# Altium schematic sheet IOandFPGA.SchDoc
size A; SheetNumber: 2; SheetTotal: 4
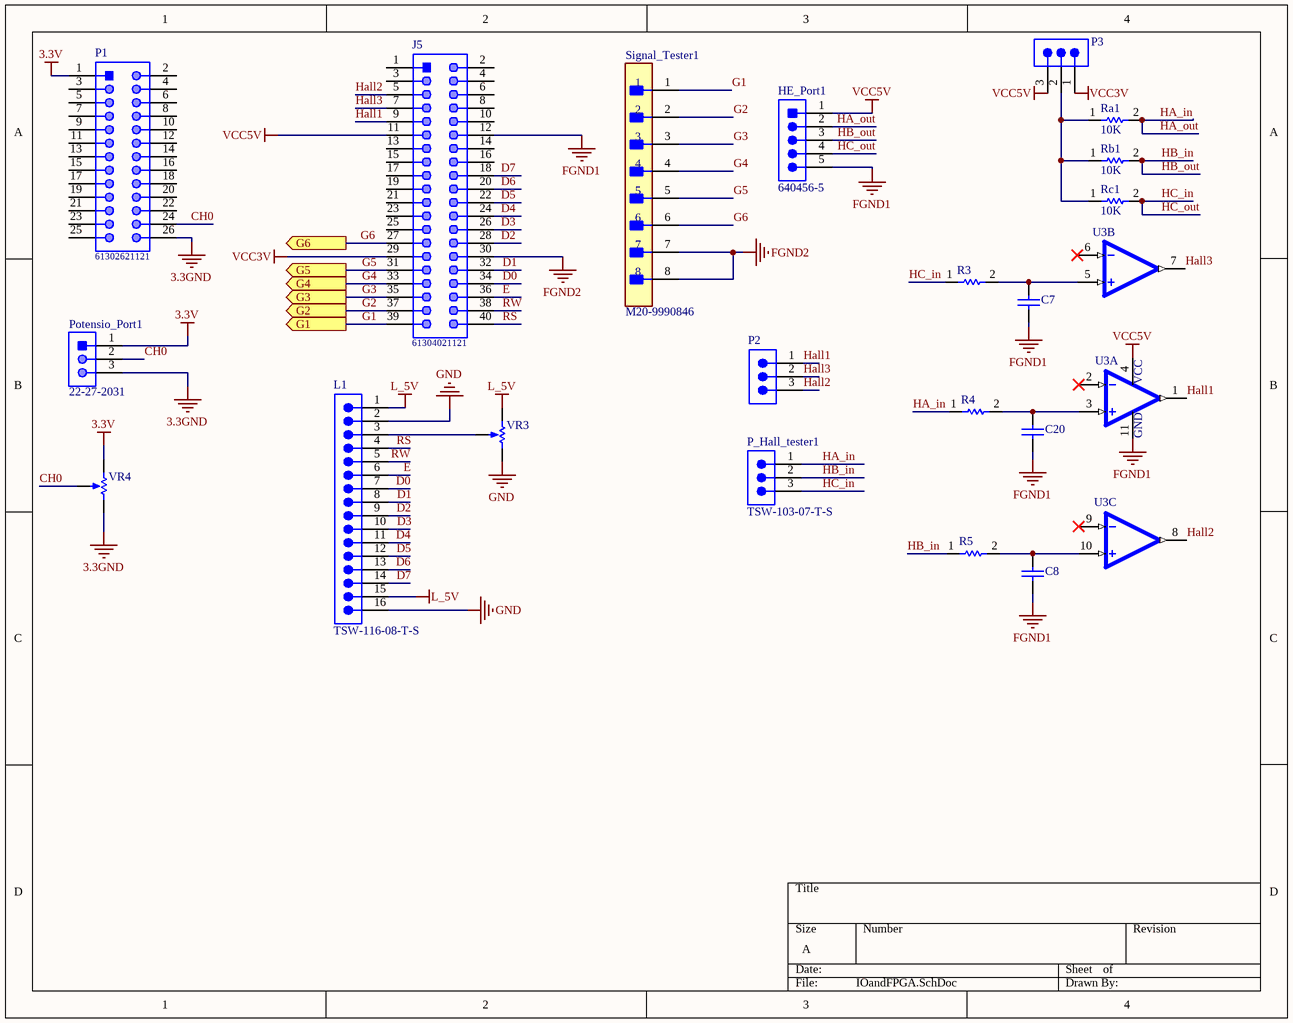
[diagram p0: IOandFPGA.SchDoc]

## Parts
C7  0.1µF  [Cap-0.1uf-50V-Ceramic1]  (value not drawn)
C8  0.1µF  [Cap-0.1uf-50V-Ceramic1]  (value not drawn)
C20  0.1µF  [Cap-0.1uf-50V-Ceramic1]  (value not drawn)
HE_Port1  640456-5  [Conn-Wire-header-5pin]
J5  61304021121  [Pin-Header-2x20pin]
L1  TSW-116-08-T-S  [LCD1602]
P1  61302621121  [DE0-nano]
P2  TSW-103-07-T-S  [Pin-Header-3pin]  (value not drawn)
P3  TSW-103-07-T-S  [Pin-Header-3pin]  (value not drawn)
P_Hall_tester1  TSW-103-07-T-S  [Pin-Header-3pin]
Potensio_Port1  22-27-2031  [Conn-Wire-header-3pin]
R3  Resistor-1-Watt  [Resistor-1-Watt]  (value not drawn)
R4  Resistor-1-Watt  [Resistor-1-Watt]  (value not drawn)
R5  Resistor-1-Watt  [Resistor-1-Watt]  (value not drawn)
Ra1  10K  [Resistor-1-Watt]
Rb1  10K  [Resistor-1-Watt]
Rc1  10K  [Resistor-1-Watt]
Signal_Tester1  M20-9990846  [Pin-Header-8pin]
U3  Op-Amp_LM324  [Op-Amp_LM324]  (value not drawn)  (parts A,B,C of 4)
VR3  3296W-1-103LF  [Resistor-Trimmer]  (value not drawn)
VR4  3852A-282-103AL  [Potentiometer]  (value not drawn)

## Ports
G1 (out), G2 (out), G3 (out), G4 (out), G5 (out), G6 (out)

## Nets
3.3GND: P1.26 Potensio_Port1.3 VR4.3(CW)
3.3V: P1.1 Potensio_Port1.1 VR4.1(CCW)
FGND1: C7.1 C8.1 C20.1 HE_Port1.5(CTS) J5.12 U3.11(GND)
FGND2: J5.30 Signal_Tester1.7 Signal_Tester1.8
GND: L1.2 L1.16 VR3.3(CW)
L_5V: L1.1 L1.15 VR3.1(CCW)
VCC3V: J5.29 P3.1
VCC5V: HE_Port1.1(DTR) J5.11 P3.3 U3.4(VCC)
CH0: P1.24 Potensio_Port1.2 VR4.2(S)
D0: J5.34 L1.7
D1: J5.32 L1.8
D2: J5.28 L1.9
D3: J5.26 L1.10
D4: J5.24 L1.11
D5: J5.22 L1.12
D6: J5.20 L1.13
D7: J5.18 L1.14
E: J5.36 L1.6
G1: J5.39 Signal_Tester1.1 ; port G1
G2: J5.37 Signal_Tester1.2 ; port G2
G3: J5.35 Signal_Tester1.3 ; port G3
G4: J5.33 Signal_Tester1.4 ; port G4
G5: J5.31 Signal_Tester1.5 ; port G5
G6: J5.27 Signal_Tester1.6 ; port G6
HA_in: HE_Port1.2(RXI) P_Hall_tester1.1 R4.1 Ra1.2  [also labelled HA_out]
Hall1: J5.9 P2.1 U3.1(1OUT)
Hall2: J5.5 P2.3 U3.8(3OUT)
Hall3: J5.7 P2.2 U3.7(2OUT)
HB_in: HE_Port1.3(TXO) P_Hall_tester1.2 R5.1 Rb1.2  [also labelled HB_out]
HC_in: HE_Port1.4(VCC) P_Hall_tester1.3 R3.1 Rc1.2  [also labelled HC_out]
RS: J5.40 L1.4
RW: J5.38 L1.5
NetC7_2: C7.2 R3.2 U3.5(2IN+)
NetC8_2: C8.2 R5.2 U3.10(3IN+)
NetC20_2: C20.2 R4.2 U3.3(1IN+)
NetL1_3: L1.3 VR3.2(S)
NetP3_2: P3.2 Ra1.1 Rb1.1 Rc1.1

Not connected (* = marked no-connect by the designer): J5 1 2 3 4 6 8 10 13 14 15 16 17 19 21 23 25; P1 2 3 4 5 6 7 8 9 10 11 12 13 14 15 16 17 18 19 20 21 22 23 25; U3 2(1IN-)* 6(2IN-)* 9(3IN-)*

## Library data of the parts
C7 C8 C20 = Cap-0.1uf-50V-Ceramic_1: Lead Capacitor X7R_EIA_ with Capacitance: 0.10F and Rated Voltage: 50Vdc; MP: RDER71H104K0K1H03B; MF: Murata; Package: NONSTANDARD; Price: None; Availability: Unavailable; Value: *; SnapEDA_Link: https://www.snapeda.com/parts/RDER71H104K0K1H03B/Murata/view-part/4545566/?ref=snap
HE_Port1 = Conn-Wire-header-5pin: Male Header, Pitch 2.54 mm, 1 x 5 Position, Height 10.03 mm, Tail Length 3.56 mm, / -55 to 105 degC, RoHS, Bulk; Manufacturer: TE Connectivity; Material, Housing: Polyester; Brand/Series: MTA-100Series; Color, Housing: White; Current, Rating: 5 / A; Temperature, Operating: -55to+105 / °C; Connector Type: MTA-100; Agency Approvals: CSA,UL; Material, Contact: CopperAlloy; Mounting Hole Size: 0.04 / "; Voltage, Rating: 250 / V; Contact Termination Area Plating: Tin; Pin Spacing: 0.1 / "; Primary Type: InterconnectSystem; Special Features: Pinstrip; Mount Angle: Vertical; Contact Centerline Spacing: 0.100 / in.; Number of Contacts: 5; Standards: RoHSCompliant,ELVCompliant,UL94V-0; Angle: Straight; Manufacturer URL: http://www.te.com; Package Reference: THD; Datasheet URL: http://sigma.octopart.com/77881742/technical_drawing/TE-Connectivity-640456-5.pdf; Package Description: Male Header, Pitch 2.54 mm, 1 x 5 Position, Height 10.03 mm, Tail Length 3.56 mm; Datasheet Version: Rev. W3; Length, Terminal Post: 0.14 / in.; Flammability Rating: UL94V-0; Mounting Type: PCMount; Termination: Solder; Length, Overall: 0.5 / "; Contact Mating Area Plating: Tin; Length, Pin: 0.14 / "; Contact Plating: Tin; Color: White; Number of Positions: 5; Type: PCBPlug; Contact Shape: Square; Number of Rows: 1; Size, Post: 0.025 / in.
J5 = Pin-Header-2x20P: THT Vertical Pin Header WR-PHD, Pitch 2.54 mm, Dual Row, 40 pins; Manufacturer: Wurth Elektronik; Contact Resistance: 20mOhm; Pitch: 2.54mm; Pin Number: 40; Withstanding Voltage: 500VAC; Gender: Male; Rated Current: 3A; Working Voltage: 250VAC; Operating Temperature: -40to105degC; Manufacturer URL: http://www.we-online.de; Orientation: Vertical; Datasheet URL: https://katalog.we-online.de/em/datasheet/6130xx21121.pdf; Package Reference: 61304021121; Row Number: Dual; Part Number: 61304021121; Packaging: Bag; Mounting Technology: THT; Publisher: WurthElektronik
L1 = LCD1602: 0.025" SQ Post Header, Through-hole, Vertical, -55 to 105 degC, 2.54 mm Pitch, 16-Pin, Male, RoHS; Manufacturer: Samtec; Pitch: 2.54 mm; PackageDescription: .025[0.64] SQ. Post Terminal Strip Assembly; Orientation: Vertical; DatasheetVersion: F-214; ComponentLink2URL: http://www.samtec.com/documents/webfiles/pdf/TSW_TH.PDF; ComponentLink3URL: http://www.samtec.com/documents/webfiles/cpdf/TSW-XXX-XX-XXX-X-XX-XXX-MKT.pdf; ComponentLink1URL: http://www.samtec.com; PackageReference: TSW-116-08-X-S; ComponentLink2Description: Datasheet; ComponentLink1Description: Manufacturer URL; ComponentLink3Description: Package Specification; Temperature Range: -55 to 105 degC; Mounting Technology: Through-hole; PartNumber: TSW-116-08-T-S; PackageVersion: DM, 8/1988; RoHS: True
P1 = DE0_NANO: THT Vertical Pin Header WR-PHD, Pitch 2.54 mm, Dual Row, 26 pins; Manufacturer: Wurth Elektronik; Pin Number: 26; Withstanding Voltage: 500VAC; Working Voltage: 250VAC; Contact Resistance: 20mOhm; Pitch: 2.54mm; Rated Current: 3A; Gender: Male; Package Reference: 61302621121; Manufacturer URL: http://www.we-online.de; Row Number: Dual; Packaging: Bag; Publisher: WurthElektronik; Datasheet URL: https://katalog.we-online.de/em/datasheet/6130xx21121.pdf; Operating Temperature: -40to105degC; Mounting Technology: THT; Orientation: Vertical; Part Number: 61302621121
P2 P3 P_Hall_tester1 = Pin-Header-3pin: 0.025" SQ Post Header, Through-hole, Vertical, -55 to 105 degC, 2.54 mm Pitch, 3-Pin, Male, RoHS; Manufacturer: Samtec; Pitch: 2.54 mm; ComponentLink1URL: http://www.samtec.com; ComponentLink3URL: http://www.samtec.com/documents/webfiles/cpdf/TSW-XXX-XX-XXX-X-XX-XXX-MKT.pdf; PartNumber: TSW-103-07-T-S; Mounting Technology: Through-hole; RoHS: True; DatasheetVersion: F-214; PackageVersion: DM, 8/1988; Temperature Range: -55 to 105 degC; ComponentLink2Description: Datasheet; ComponentLink1Description: Manufacturer URL; Orientation: Vertical; PackageReference: TSW-103-07-X-S; ComponentLink3Description: Package Specification; ComponentLink2URL: http://www.samtec.com/documents/webfiles/pdf/TSW_TH.PDF; PackageDescription: .025[0.64] SQ. Post Terminal Strip Assembly
Potensio_Port1 = Conn-Wire-header-3pin: Male Header, Pitch 2.54 mm, 1 x 3 Position, Height 11.7 mm, Tail Length 3.56 mm, -40 to 80 degC, RoHS, Bulk; Manufacturer: Molex; Voltage rating: 250V; Current rating: 4A; Package Reference: 22-27-2031; Housing material: Nylon(UL94V-0); Operating temperature: 0°Cto+75°C; Package Description: Male Header, Pitch 2.54 mm, 1 x 3 Position, Height 11.7 mm, Tail Length 3.56 mm; Package URL: http://www.molex.com/pdm_docs/sd/022272031_sd.pdf; Datasheet Version: 06/2016; Manufacturer URL: http://www.molex.com/; Mounting Technology: ThroughHole; Datasheet URL: http://www.molex.com/webdocs/datasheets/pdf/en-us/0022272031_PCB_HEADERS.pdf; Contact material: Tinplatedbrass
R3-R5 Ra1 Rb1 Rc1 = Resistor-1-Watt: Resistor; Manufacturer_Name: Ohmite; Manufacturer_Part_Number: OK1025E-R52; Datasheet Link: https://www.alliedelec.com/m/d/7f961050c862e52d900c42b673f6b00a.pdf; Mouser Part Number: 588-OK1025E-R52; Mouser Price/Stock: https://www.mouser.co.uk/ProductDetail/Ohmite/OK1025E-R52?qs=AkUtuiJmyfnfEYTpIxxGIg%3D%3D
Signal_Tester1 = Pin-Header-8pin: CONN HEADER VERT 8POS 2.54MM; Connector Type: Male Pin; Gender: Male; Insulation Resistance: 1GR; Number of Positions: 8; Contact Resistance: 30mR; Current Rating: 3A; Termination: Solder; Case/Package: SIL; RoHS Compliant: Yes; Series: M20; Housing Material: Nylon; Radiation Hardening: No; Package Quantity: 1000; Contact Material: Brass; Contact Plating: Tin; Max Operating Temperature: 105°C; Contact Mating Length: 0.24inch; Depth: 2.54mm; Color: Black; Number of Contacts: 8; Mount: Through Hole; Number of Rows: 1; Packaging: Bulk; Min Operating Temperature: -40°C; Max Current Rating: 3A; REACH SVHC: No SVHC; Pitch: 2.54mm; Housing Color: Black; Orientation: Straight; Length: 20.32mm; Contact Type: Male Pin
U3 = Op-Amp_LM324: MP: LM324NE3; Package: None; Availability: Unavailable; Price: None; Value: *
VR3 = Resistor-Trimmer: Square Trimpot(R) Trimming Potentiometer, 10 KOhm, +/- 10%, 0.5 W, -55 to 125 degC, 3-Pin THD, RoHS, Tube; Voltage Rating: 75 V; Resistance: 120 Ohm; Tolerance: 1%; Power Rating: 100 mW; Case\Package: 0603; Type (Resistor): Thick Film; PackageDescription: 3-Pin Through Hole Device, Body 9.53 x 4.83 mm, Pitch 2.54 mm; RoHSCompliant: true; Package Quantity: 5000; Case Code (Metric): 1608; PackageReference: 3296W; ComponentLink2Description: Datasheet; REACH SVHC: Unknown; Case Code (Imperial): 0603; ComponentLink1URL: http://www.bourns.com/; Width: 0.85 mm; Radiation Hardening: No; Min Operating Temperature: -55 degC; Mount: Surface Mount; ComponentLink1Description: Manufacturer URL; Max Operating Temperature: 155 degC; Weight: 7.1E-05 oz; Pins: 2; DatasheetVersion: May-16; Packaging: Tape and Reel; Height: 0.45 mm; Length: 1.55 mm; ComponentLink2URL: http://www.bourns.com/docs/Product-Datasheets/3296.pdf
VR4 = Potentiometer: Diameter Panel Control, 10 KOhm, +/- 10%, 2 W, -1 to 125 degC, 3-Pin THD, RoHS, Bulk; Manufacturer: Bourns; Temperature Coefficient: ±150ppm/degC; Number of Gangs: 1; Other Names: 3852A282103AL; Actuator Length: 0.875"(22.23mm); Resistive Material: Cermet; PCN Design/Specification: PBTResinJun/2011; Rotation: 280deg; PCN Other: MultipleChanges01/Dec/2012; Catalog Drawings: 3852SeriesSide1 / 3852SeriesSide2; Online Catalog: 3852and3856Series; Associated Product: 36-8560-ND / -KNOBINSTRUMW/DIALRND.9"DIA / 36-8555-ND / -KNOBINSTRUMSKIRTEDRND.7"DIA / 36-8556-ND / -KNOBINSTRUMSKIRTEDRND.9"DIA / 36-8565-ND / -KNOBINSTRUMDBLBARRND.7"DIA / 36-8566-ND / -KNOBINSTRUMDBLBARRND.9"DIA / 36-8568-ND / -KNOBINSTRUMSGLBARRND.7"DIA / 36-8569-ND / -KNOBINSTRUMSGLBARRND.9"DIA / 36-8559-ND / -KNOBINSTRUMW/DIALRND.7"DIA / 226-1006-ND / -KNOBBLKGLOSS.75"DIA.250"SHAFT / 226-1007-ND / -KNOBBLKGLOSS.925"DIA.250"SHAFT / 226-1011-ND / -KNOBBLKGLOS; Actuator Diameter: 0.250"(6.35mm); Built in Switch: None; Resistance (Ohms): 10k; Power (Watts): 2W; Actuator Type: Slotted; Standard Package: 45; Tolerance: ±10%; Taper: Linear; Series: 3852; Packaging: Bulk; Category: Potentiometers,VariableResistors; Bushing Thread: 3/8-32; Datasheet URL: https://datasheet.ciiva.com/11831/0900766b80f93b4b-11831016.pdf; Datasheet Version: Sep-14; Number of Turns: 1; Family: RotaryPotentiometers,Rheostats; Termination Style: SolderLug; RoHS Information: 3852A-LMaterialDeclaration; Mounting Type: PanelMount; Manufacturer URL: http://www.bourns.com/